# EAGLE schematic Relay-Board_Rack-PDU_2.0 (EAGLE 9.2.1)

## Sheet 1 of 3: POWER
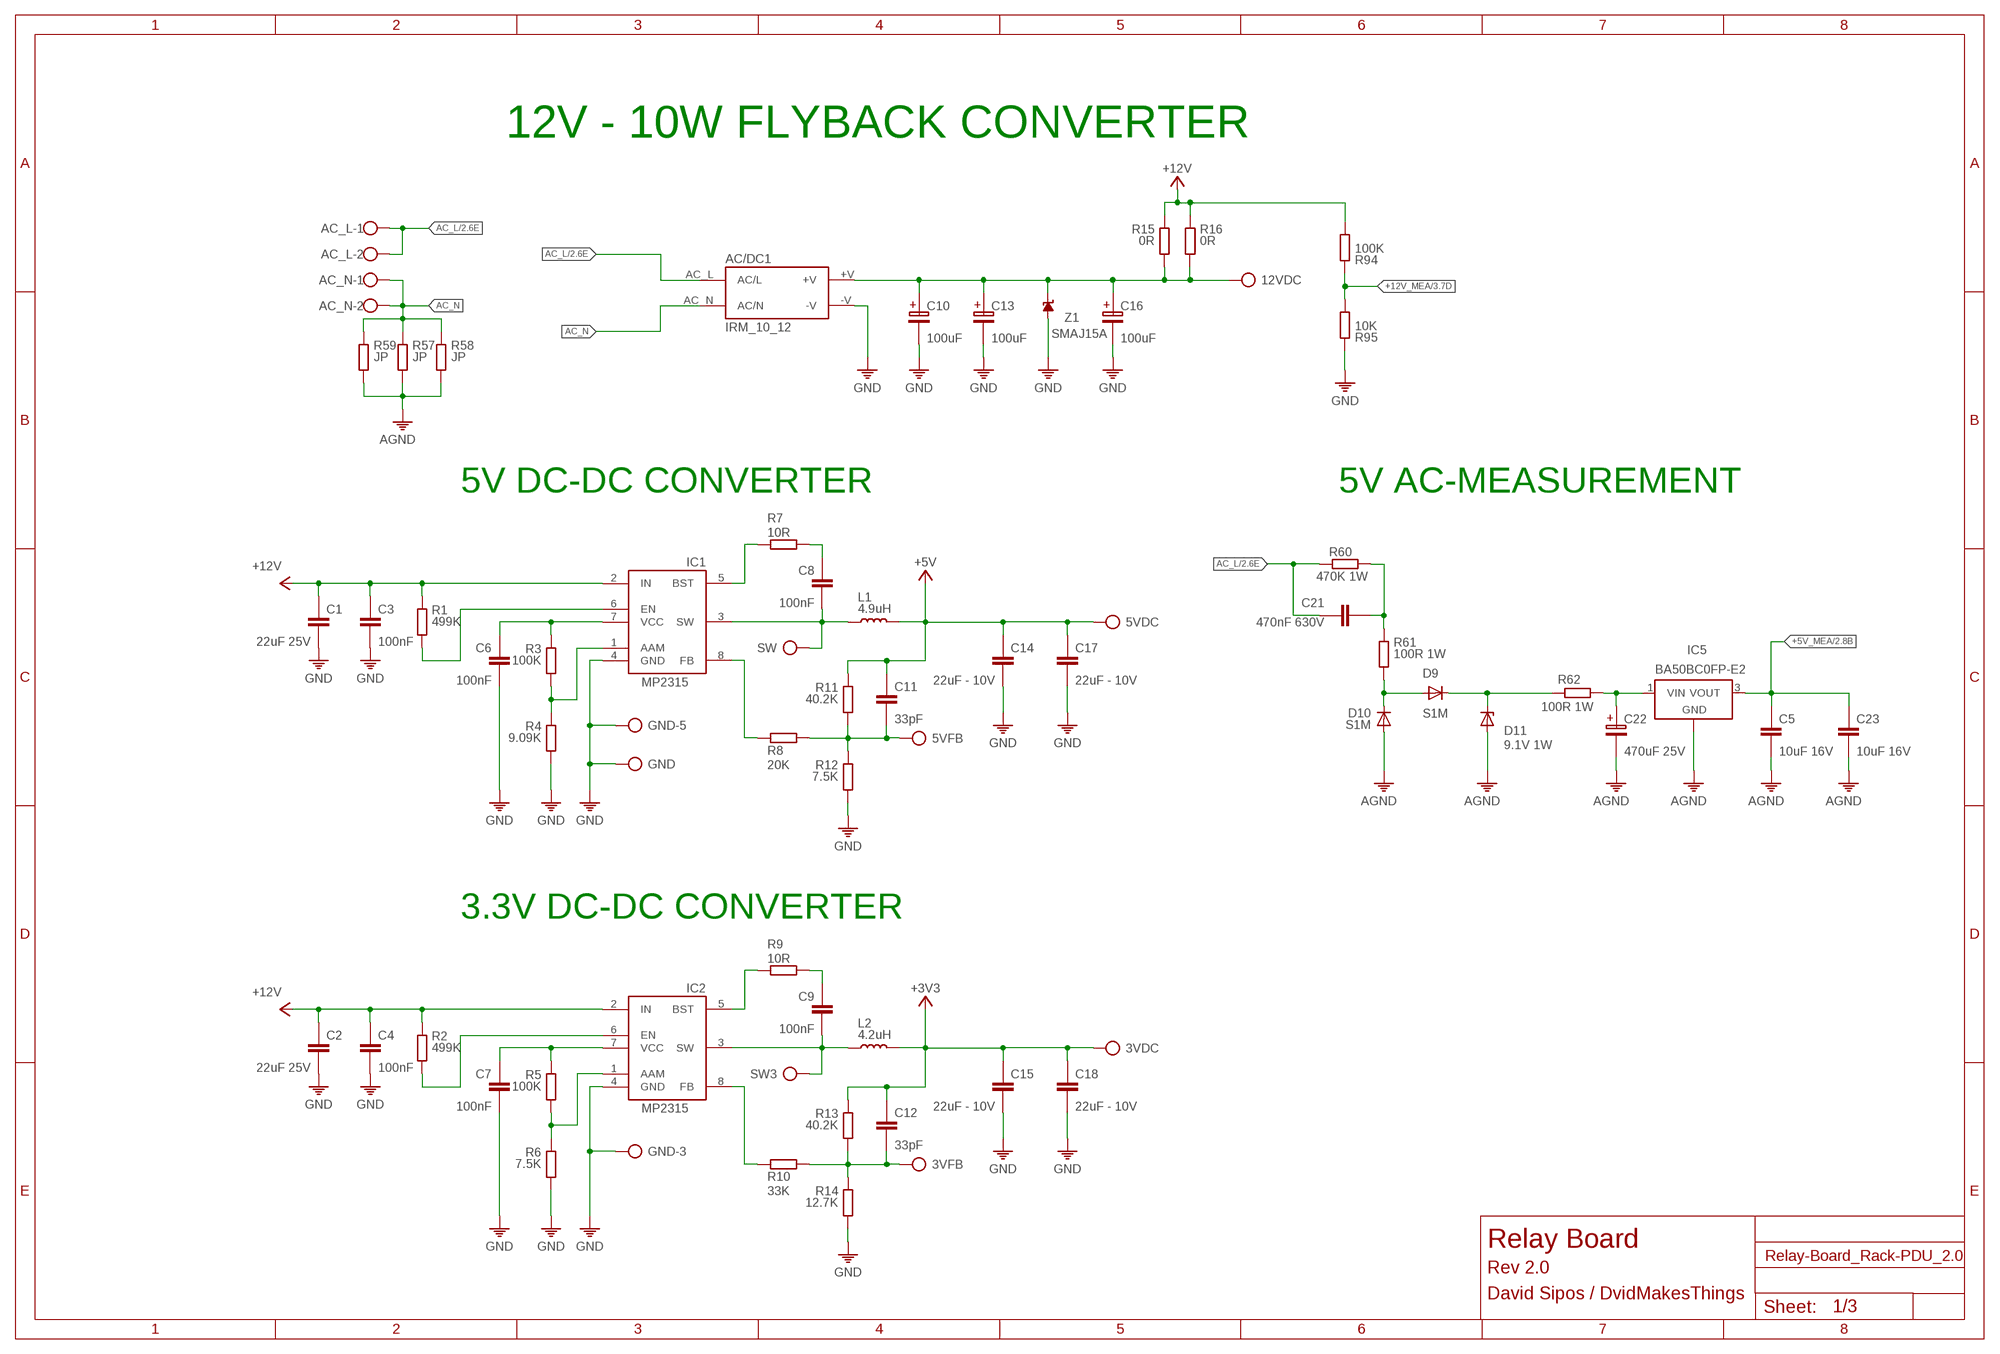
[diagram p0: schematic, sheet 1]

### Parts
3VDC  TP  [TP]
3VFB  TP  [TP]
5VDC  TP  [TP]
5VFB  TP  [TP]
12VDC  TP  [TP]
AC/DC1  IRM_10_12  [IRM_10_12]
AC_L  W237-102  [W237-102]
AC_N  W237-102  [W237-102]
C1  22uF 25V  C-1206  [C1206]
C2  22uF 25V  C-1206  [C1206]
C3  100nF  C0402  [0402]
C4  100nF  C0402  [0402]
C5  10uF 16V  C-1206  [C1206]
C6  100nF  C0402  [0402]
C7  100nF  C0402  [0402]
C8  100nF  C0402  [0402]
C9  100nF  C0402  [0402]
C10  100uF  CPOL  [100UF-16V]
C11  33pF  C0402  [0402]
C12  33pF  C0402  [0402]
C13  100uF  CPOL  [100UF-16V]
C14  22uF - 10V  C-1206  [C1206]
C15  22uF - 10V  C-1206  [C1206]
C16  100uF  CPOL  [100UF-16V]
C17  22uF - 10V  C-1206  [C1206]
C18  22uF - 10V  C-1206  [C1206]
C21  470nF 630V  C-2225  [2225]
C22  470uF 25V  CPOL  [100UF-16V]
C23  10uF 16V  C-1206  [C1206]
D9  S1M  [SMA]
D10  S1M  [SMA]
D11  9.1V 1W  ZENER-DIODESMB  [SMB]
GND  TP  [TP]
GND-3  TP  [TP]
GND-5  TP  [TP]
IC1  MP2315GJ-Z  MP2315TSOT23-8  [SOT65P280X110-8N]
IC2  MP2315S  MP2315TSOT23-8  [SOT65P280X110-8N]
IC5  BA50BC0FP-E2  L4941BDT  [DPAK]
L1  4.9uH  L  [SRR5228A]
L2  4.2uH  L  [SRR5228A]
R1  499K  R0402  [0402]
R2  499K  R0402  [0402]
R3  100K  R0402  [0402]
R4  9.09K  R0402  [0402]
R5  100K  R0402  [0402]
R6  7.5K  R0402  [0402]
R7  10R  R0402  [0402]
R8  20K  R0402  [0402]
R9  10R  R0402  [0402]
R10  33K  R0402  [0402]
R11  40.2K  R0402  [0402]
R12  7.5K  R0402  [0402]
R13  40.2K  R0402  [0402]
R14  12.7K  R0402  [0402]
R15  0R  R0805  [0805]
R16  0R  R0805  [0805]
R57  JP  R0402  [0402]
R58  JP  R0402  [0402]
R59  JP  R0402  [0402]
R60  470K 1W  R2512  [2512]
R61  100R 1W  R2512  [2512]
R62  100R 1W  R2512  [2512]
R94  100K  R0402  [0402]
R95  10K  R0402  [0402]
SW  TP  [TP]
SW3  TP  [TP]
Z1  SMAJ15A  SUPRESSOR_TVS-UD-SMAJ  [SUPRESSOR_SMAJ]

### Nets
5VFB: 5VFB.TP C11.2 R8.2 R11.2 R12.1
+3V3: 3VDC.TP C12.1 C15.1 C18.1 L2.2 R13.1 ; also sheet 3
+5V: 5VDC.TP C11.1 C14.1 C17.1 L1.2 R11.1 ; also sheet 3
+5V_MEA: C5.1 C23.1 IC5.3(VOUT) ; also sheet 2,3
+12V: C1.1 C2.1 C3.1 C4.1 IC1.2(IN) IC2.2(IN) R1.1 R2.1 R15.1 R16.1 R94.2 ; also sheet 2,3
+12V_MEA: R94.1 R95.2 ; also sheet 3
AC_L: AC/DC1.AC_L(AC/L) AC_L.1 AC_L.2 C21.1 R60.1 ; also sheet 2
AC_N: AC/DC1.AC_N(AC/N) AC_N.1 AC_N.2 R57.1 R58.1 R59.1
AGND: C5.2 C22.2 C23.2 D10.A D11.A IC5.4(GND) R57.2 R58.2 R59.2 ; also sheet 2
GND: AC/DC1.-V C1.2 C2.2 C3.2 C4.2 C6.2 C7.2 C10.2 C13.2 C14.2 C15.2 C16.2 C17.2 C18.2 GND-3.TP GND-5.TP GND.TP IC1.4(GND) IC2.4(GND) R4.2 R6.2 R12.2 R14.2 R95.1 Z1.A ; also sheet 3
N$2: 12VDC.TP AC/DC1.+V C10.1 C13.1 C16.1 R15.2 R16.2 Z1.C
N$3: C21.2 R60.2 R61.1
N$14: IC1.5(BST) R7.2
N$16: IC1.8(FB) R8.1
N$18: C8.1 R7.1
N$19: IC1.6(EN) R1.2
N$20: D9.A D10.C R61.2
N$21: C6.1 IC1.7(VCC) R3.1
N$25: C22.1 IC5.1(VIN) R62.2
N$26: D9.C D11.C R62.1
N$38: IC2.5(BST) R9.2
N$39: IC2.8(FB) R10.1
N$41: C9.1 R9.1
N$42: 3VFB.TP C12.2 R10.2 R13.2 R14.1
N$43: IC2.6(EN) R2.2
N$44: C7.1 IC2.7(VCC) R5.1
N$45: IC1.1(AAM) R3.2 R4.1
N$46: IC2.1(AAM) R5.2 R6.1
SW3: C9.2 IC2.3(SW) L2.1 SW3.TP
SW5: C8.2 IC1.3(SW) L1.1 SW.TP

### Notes on the sheet
- 12V - 10W FLYBACK CONVERTER
- 5V DC-DC CONVERTER | 5V AC-MEASUREMENT
- BA50BC0FP-E2
- 3.3V DC-DC CONVERTER
- Relay Board
- Rev 2.0
- David Sipos / DvidMakesThings

## Sheet 2 of 3: RELAYS
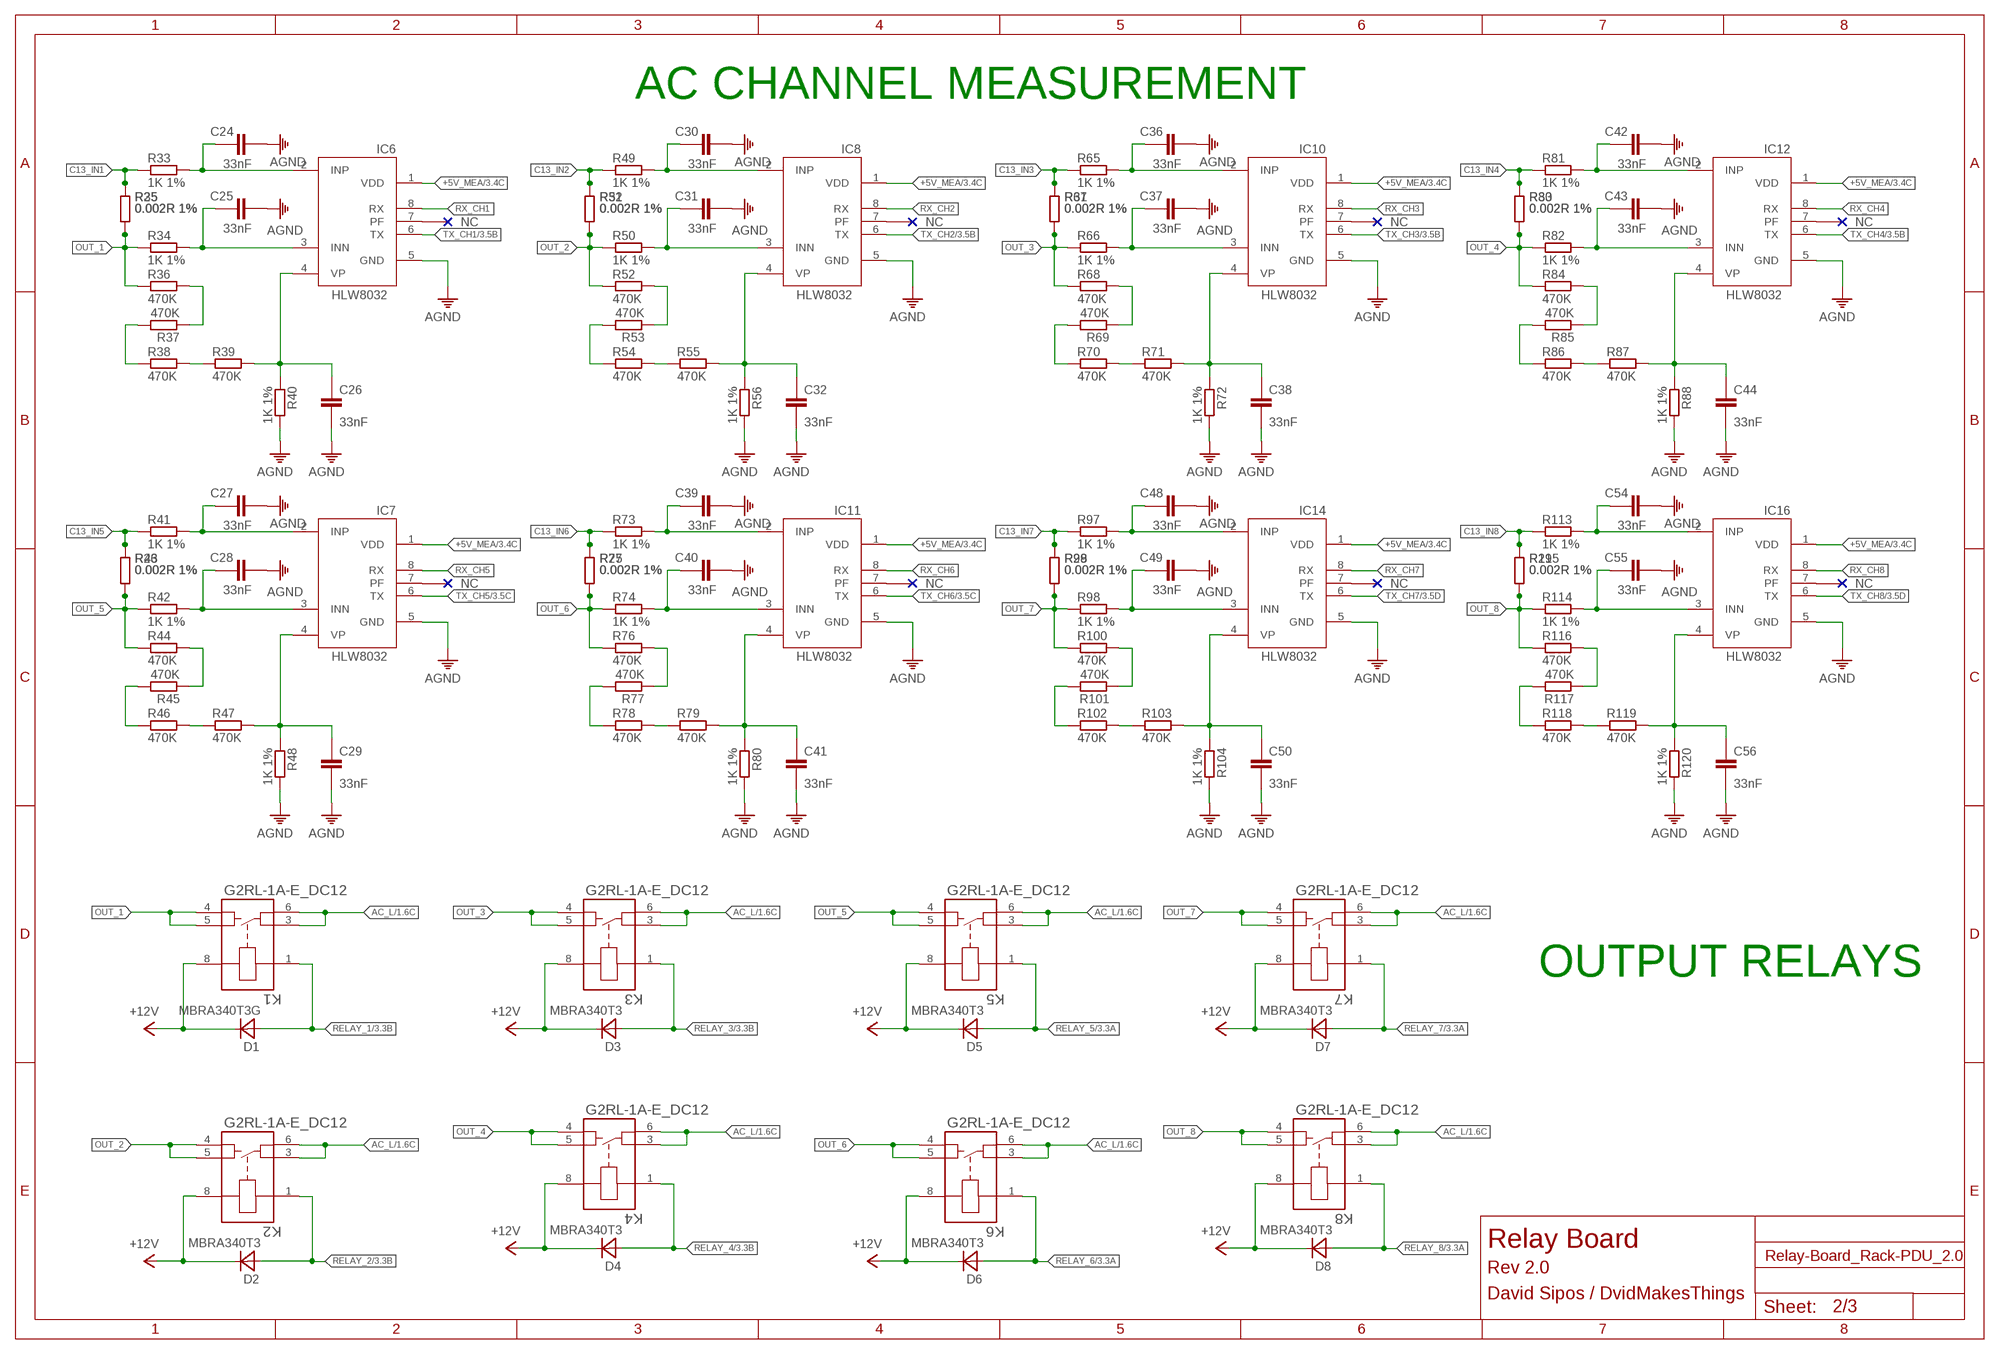
[diagram p1: schematic, sheet 2]

### Parts
C24  33nF  C-1206  [C1206]
C25  33nF  C-1206  [C1206]
C26  33nF  C-1206  [C1206]
C27  33nF  C-1206  [C1206]
C28  33nF  C-1206  [C1206]
C29  33nF  C-1206  [C1206]
C30  33nF  C-1206  [C1206]
C31  33nF  C-1206  [C1206]
C32  33nF  C-1206  [C1206]
C36  33nF  C-1206  [C1206]
C37  33nF  C-1206  [C1206]
C38  33nF  C-1206  [C1206]
C39  33nF  C-1206  [C1206]
C40  33nF  C-1206  [C1206]
C41  33nF  C-1206  [C1206]
C42  33nF  C-1206  [C1206]
C43  33nF  C-1206  [C1206]
C44  33nF  C-1206  [C1206]
C48  33nF  C-1206  [C1206]
C49  33nF  C-1206  [C1206]
C50  33nF  C-1206  [C1206]
C54  33nF  C-1206  [C1206]
C55  33nF  C-1206  [C1206]
C56  33nF  C-1206  [C1206]
D1  MBRA340T3G  MBRA340T3  [SMA]
D2  MBRA340T3  [SMA]
D3  MBRA340T3  [SMA]
D4  MBRA340T3  [SMA]
D5  MBRA340T3  [SMA]
D6  MBRA340T3  [SMA]
D7  MBRA340T3  [SMA]
D8  MBRA340T3  [SMA]
IC6  HLW8032  [SO8]
IC7  HLW8032  [SO8]
IC8  HLW8032  [SO8]
IC10  HLW8032  [SO8]
IC11  HLW8032  [SO8]
IC12  HLW8032  [SO8]
IC14  HLW8032  [SO8]
IC16  HLW8032  [SO8]
K1  G2RL-1A-E_DC12  [RELAY_G2RL-1A-E_DC5_OMR]
K2  G2RL-1A-E_DC12  [RELAY_G2RL-1A-E_DC5_OMR]
K3  G2RL-1A-E_DC12  [RELAY_G2RL-1A-E_DC5_OMR]
K4  G2RL-1A-E_DC12  [RELAY_G2RL-1A-E_DC5_OMR]
K5  G2RL-1A-E_DC12  [RELAY_G2RL-1A-E_DC5_OMR]
K6  G2RL-1A-E_DC12  [RELAY_G2RL-1A-E_DC5_OMR]
K7  G2RL-1A-E_DC12  [RELAY_G2RL-1A-E_DC5_OMR]
K8  G2RL-1A-E_DC12  [RELAY_G2RL-1A-E_DC5_OMR]
R25  0.002R 1%  R2512  [2512]
R26  0.002R 1%  R2512  [2512]
R27  0.002R 1%  R2512  [2512]
R28  0.002R 1%  R2512  [2512]
R29  0.002R 1%  R2512  [2512]
R30  0.002R 1%  R2512  [2512]
R31  0.002R 1%  R2512  [2512]
R32  0.002R 1%  R2512  [2512]
R33  1K 1%  R1206  [1206]
R34  1K 1%  R1206  [1206]
R35  0.002R 1%  R2512  [2512]
R36  470K  R1206  [1206]
R37  470K  R1206  [1206]
R38  470K  R1206  [1206]
R39  470K  R1206  [1206]
R40  1K 1%  R1206  [1206]
R41  1K 1%  R1206  [1206]
R42  1K 1%  R1206  [1206]
R43  0.002R 1%  R2512  [2512]
R44  470K  R1206  [1206]
R45  470K  R1206  [1206]
R46  470K  R1206  [1206]
R47  470K  R1206  [1206]
R48  1K 1%  R1206  [1206]
R49  1K 1%  R1206  [1206]
R50  1K 1%  R1206  [1206]
R51  0.002R 1%  R2512  [2512]
R52  470K  R1206  [1206]
R53  470K  R1206  [1206]
R54  470K  R1206  [1206]
R55  470K  R1206  [1206]
R56  1K 1%  R1206  [1206]
R65  1K 1%  R1206  [1206]
R66  1K 1%  R1206  [1206]
R67  0.002R 1%  R2512  [2512]
R68  470K  R1206  [1206]
R69  470K  R1206  [1206]
R70  470K  R1206  [1206]
R71  470K  R1206  [1206]
R72  1K 1%  R1206  [1206]
R73  1K 1%  R1206  [1206]
R74  1K 1%  R1206  [1206]
R75  0.002R 1%  R2512  [2512]
R76  470K  R1206  [1206]
R77  470K  R1206  [1206]
R78  470K  R1206  [1206]
R79  470K  R1206  [1206]
R80  1K 1%  R1206  [1206]
R81  1K 1%  R1206  [1206]
R82  1K 1%  R1206  [1206]
R83  0.002R 1%  R2512  [2512]
R84  470K  R1206  [1206]
R85  470K  R1206  [1206]
R86  470K  R1206  [1206]
R87  470K  R1206  [1206]
R88  1K 1%  R1206  [1206]
R97  1K 1%  R1206  [1206]
R98  1K 1%  R1206  [1206]
R99  0.002R 1%  R2512  [2512]
R100  470K  R1206  [1206]
R101  470K  R1206  [1206]
R102  470K  R1206  [1206]
R103  470K  R1206  [1206]
R104  1K 1%  R1206  [1206]
R113  1K 1%  R1206  [1206]
R114  1K 1%  R1206  [1206]
R115  0.002R 1%  R2512  [2512]
R116  470K  R1206  [1206]
R117  470K  R1206  [1206]
R118  470K  R1206  [1206]
R119  470K  R1206  [1206]
R120  1K 1%  R1206  [1206]

### Nets
+5V_MEA: IC6.1(VDD) IC7.1(VDD) IC8.1(VDD) IC10.1(VDD) IC11.1(VDD) IC12.1(VDD) IC14.1(VDD) IC16.1(VDD) ; also sheet 1,3
+12V: D1.C D2.C D3.C D4.C D5.C D6.C D7.C D8.C K1.8 K2.8 K3.8 K4.8 K5.8 K6.8 K7.8 K8.8 ; also sheet 1,3
AC_L: K1.3 K1.6 K2.3 K2.6 K3.3 K3.6 K4.3 K4.6 K5.3 K5.6 K6.3 K6.6 K7.3 K7.6 K8.3 K8.6 ; also sheet 1
AGND: C24.2 C25.2 C26.2 C27.2 C28.2 C29.2 C30.2 C31.2 C32.2 C36.2 C37.2 C38.2 C39.2 C40.2 C41.2 C42.2 C43.2 C44.2 C48.2 C49.2 C50.2 C54.2 C55.2 C56.2 IC6.5(GND) IC7.5(GND) IC8.5(GND) IC10.5(GND) IC11.5(GND) IC12.5(GND) IC14.5(GND) IC16.5(GND) R40.2 R48.2 R56.2 R72.2 R80.2 R88.2 R104.2 R120.2 ; also sheet 1
C13_IN1: R25.2 R33.1 R35.2
C13_IN2: R32.2 R49.1 R51.2
C13_IN3: R31.2 R65.1 R67.2
C13_IN4: R30.2 R81.1 R83.2
C13_IN5: R26.2 R41.1 R43.2
C13_IN6: R27.2 R73.1 R75.2
C13_IN7: R28.2 R97.1 R99.2
C13_IN8: R29.2 R113.1 R115.2
N$12: C24.1 IC6.2(INP) R33.2
N$22: C25.1 IC6.3(INN) R34.2
N$27: R36.2 R37.1
N$28: R37.2 R38.1
N$29: R38.2 R39.1
N$30: C26.1 IC6.4(VP) R39.2 R40.1
N$31: C27.1 IC7.2(INP) R41.2
N$32: C28.1 IC7.3(INN) R42.2
N$33: R44.2 R45.1
N$34: R45.2 R46.1
N$35: R46.2 R47.1
N$36: C29.1 IC7.4(VP) R47.2 R48.1
N$47: C30.1 IC8.2(INP) R49.2
N$48: C31.1 IC8.3(INN) R50.2
N$49: R52.2 R53.1
N$50: R53.2 R54.1
N$51: R54.2 R55.1
N$52: C32.1 IC8.4(VP) R55.2 R56.1
N$59: C36.1 IC10.2(INP) R65.2
N$60: C37.1 IC10.3(INN) R66.2
N$61: R68.2 R69.1
N$62: R69.2 R70.1
N$63: R70.2 R71.1
N$64: C38.1 IC10.4(VP) R71.2 R72.1
N$65: C39.1 IC11.2(INP) R73.2
N$66: C40.1 IC11.3(INN) R74.2
N$67: R76.2 R77.1
N$68: R77.2 R78.1
N$69: R78.2 R79.1
N$70: C41.1 IC11.4(VP) R79.2 R80.1
N$71: C42.1 IC12.2(INP) R81.2
N$72: C43.1 IC12.3(INN) R82.2
N$73: R84.2 R85.1
N$74: R85.2 R86.1
N$75: R86.2 R87.1
N$76: C44.1 IC12.4(VP) R87.2 R88.1
N$83: C48.1 IC14.2(INP) R97.2
N$84: C49.1 IC14.3(INN) R98.2
N$85: R100.2 R101.1
N$86: R101.2 R102.1
N$87: R102.2 R103.1
N$88: C50.1 IC14.4(VP) R103.2 R104.1
N$95: C54.1 IC16.2(INP) R113.2
N$96: C55.1 IC16.3(INN) R114.2
N$97: R116.2 R117.1
N$98: R117.2 R118.1
N$99: R118.2 R119.1
N$100: C56.1 IC16.4(VP) R119.2 R120.1
OUT_1: K1.4 K1.5 R25.1 R34.1 R35.1 R36.1
OUT_2: K2.4 K2.5 R32.1 R50.1 R51.1 R52.1
OUT_3: K3.4 K3.5 R31.1 R66.1 R67.1 R68.1
OUT_4: K4.4 K4.5 R30.1 R82.1 R83.1 R84.1
OUT_5: K5.4 K5.5 R26.1 R42.1 R43.1 R44.1
OUT_6: K6.4 K6.5 R27.1 R74.1 R75.1 R76.1
OUT_7: K7.4 K7.5 R28.1 R98.1 R99.1 R100.1
OUT_8: K8.4 K8.5 R29.1 R114.1 R115.1 R116.1
RELAY_1: D1.A K1.1 ; also sheet 3
RELAY_2: D2.A K2.1 ; also sheet 3
RELAY_3: D3.A K3.1 ; also sheet 3
RELAY_4: D4.A K4.1 ; also sheet 3
RELAY_5: D5.A K5.1 ; also sheet 3
RELAY_6: D6.A K6.1 ; also sheet 3
RELAY_7: D7.A K7.1 ; also sheet 3
RELAY_8: D8.A K8.1 ; also sheet 3
RX_CH1: IC6.8(RX)
RX_CH2: IC8.8(RX)
RX_CH3: IC10.8(RX)
RX_CH4: IC12.8(RX)
RX_CH5: IC7.8(RX)
RX_CH6: IC11.8(RX)
RX_CH7: IC14.8(RX)
RX_CH8: IC16.8(RX)
TX_CH1: IC6.6(TX) ; also sheet 3
TX_CH2: IC8.6(TX) ; also sheet 3
TX_CH3: IC10.6(TX) ; also sheet 3
TX_CH4: IC12.6(TX) ; also sheet 3
TX_CH5: IC7.6(TX) ; also sheet 3
TX_CH6: IC11.6(TX) ; also sheet 3
TX_CH7: IC14.6(TX) ; also sheet 3
TX_CH8: IC16.6(TX) ; also sheet 3
Unconnected: IC6.7(PF) IC7.7(PF) IC8.7(PF) IC10.7(PF) IC11.7(PF) IC12.7(PF) IC14.7(PF) IC16.7(PF)

### Notes on the sheet
- AC CHANNEL MEASUREMENT
- OUTPUT RELAYS
- Relay Board
- Rev 2.0
- David Sipos / DvidMakesThings

## Sheet 3 of 3: DRIVERS AND PERIPHERALS
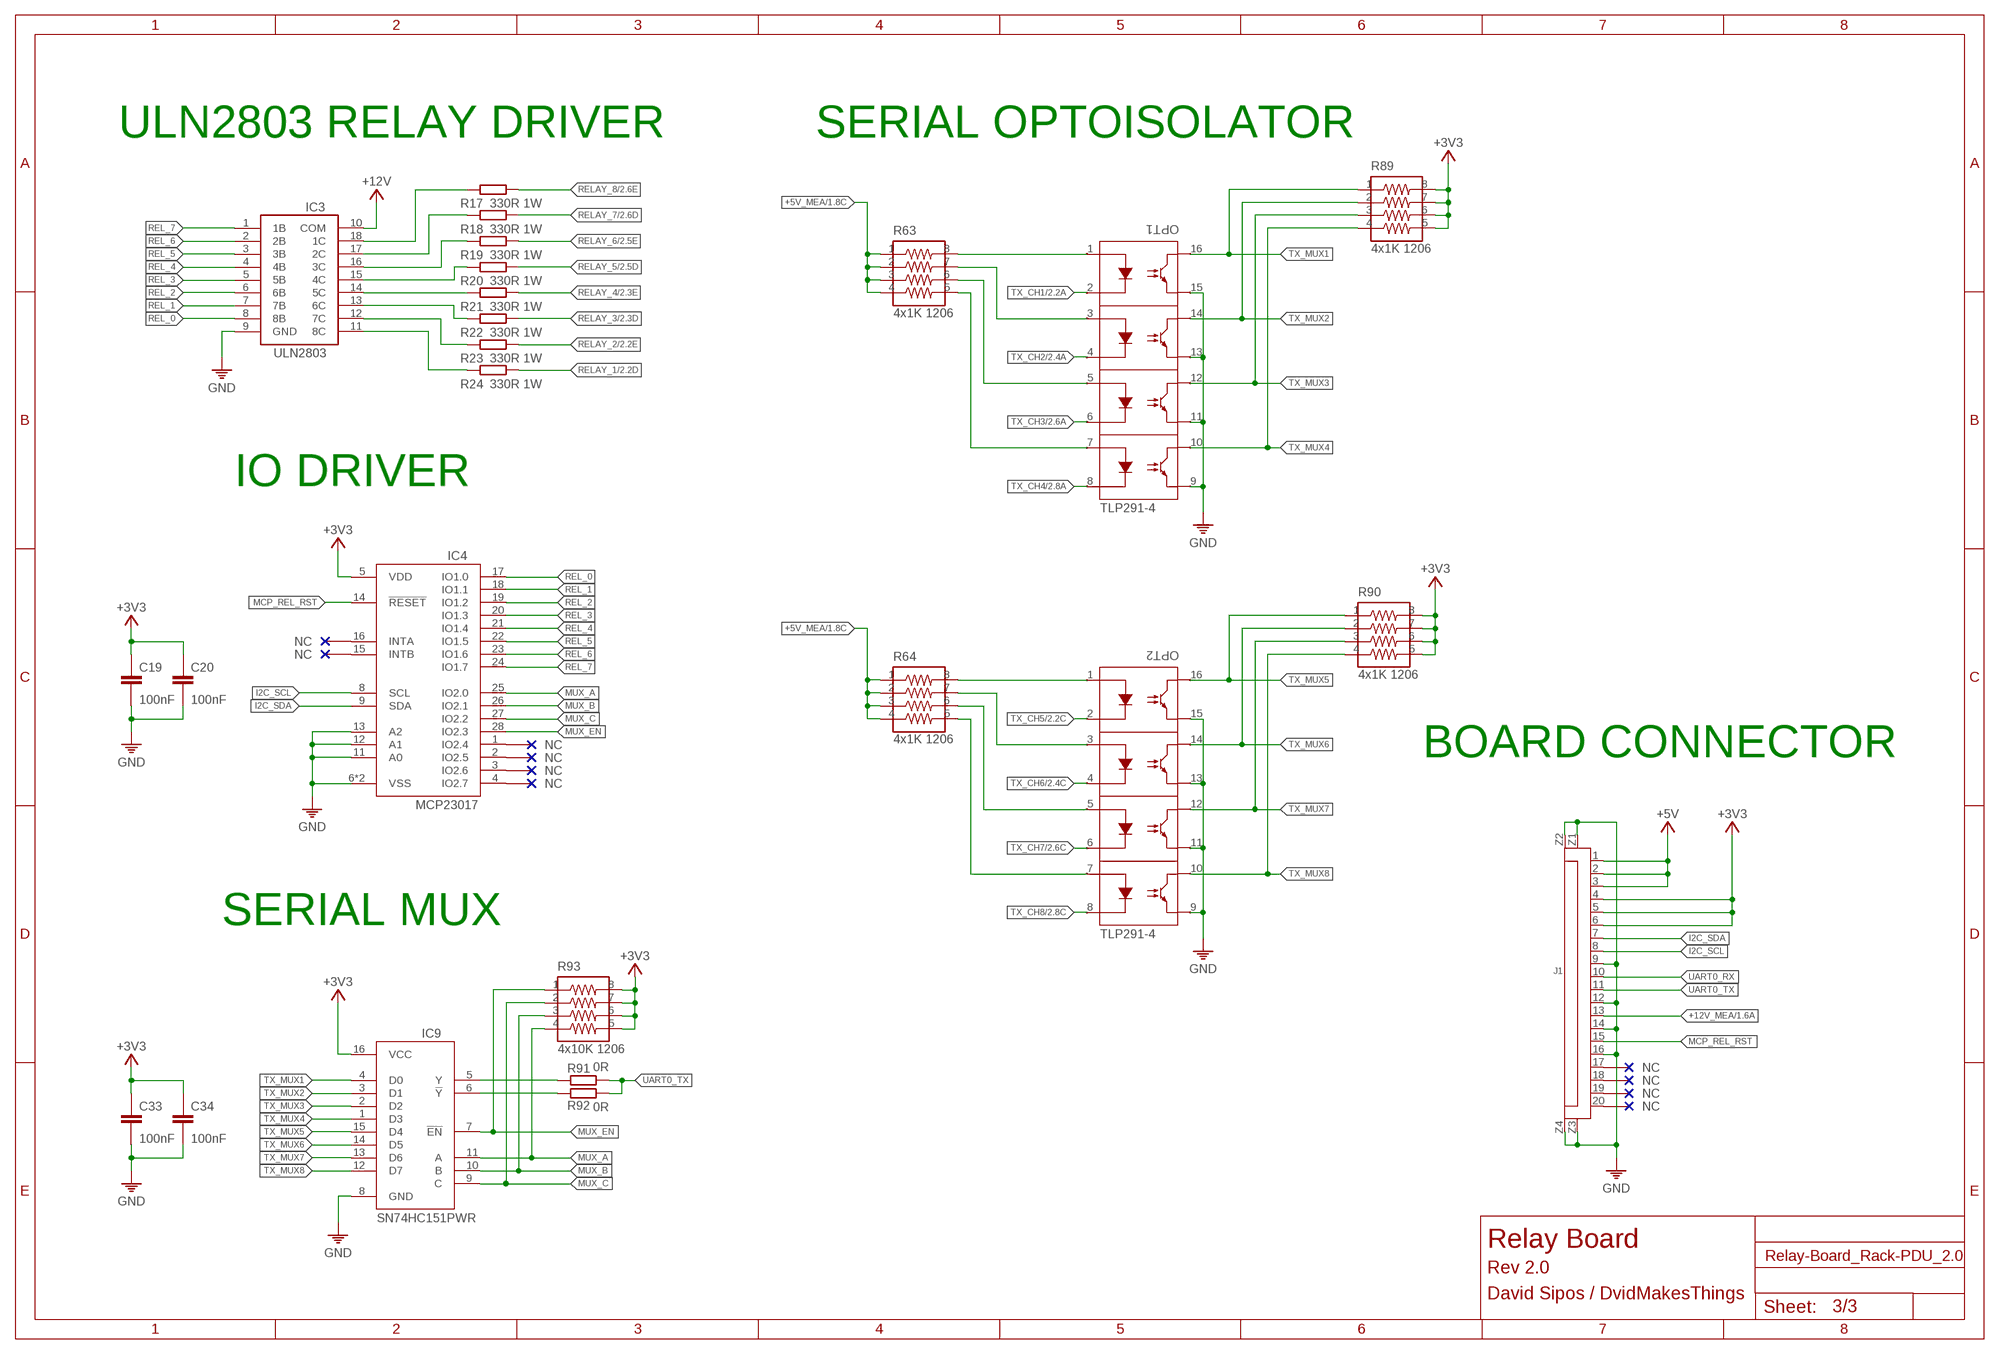
[diagram p2: schematic, sheet 3]

### Parts
C19  100nF  C-0402  [C0402]
C20  100nF  C-0402  [C0402]
C33  100nF  C-0402  [C0402]
C34  100nF  C-0402  [C0402]
IC3  ULN2803A  ULN2803  [SO18]
IC4  MCP23017-E/ML  [QFN28[6X6]ML]
IC9  SN74HC151PWR  [TSSOP16]
J1  FPC20-H  [FPC20]
OPT1  TLP291-4  TLP291-4(GB-TP,E)1  [SO16]
OPT2  TLP291-4  TLP291-4(GB-TP,E)1  [SO16]
R17  330R 1W  R1206  [1206]
R18  330R 1W  R1206  [1206]
R19  330R 1W  R1206  [1206]
R20  330R 1W  R1206  [1206]
R21  330R 1W  R1206  [1206]
R22  330R 1W  R1206  [1206]
R23  330R 1W  R1206  [1206]
R24  330R 1W  R1206  [1206]
R63  4x1K 1206  742C083103JP  [742C083103JP]
R64  4x1K 1206  742C083103JP  [742C083103JP]
R89  4x1K 1206  742C083103JP  [742C083103JP]
R90  4x1K 1206  742C083103JP  [742C083103JP]
R91  0R  R0402  [0402]
R92  0R  R0402  [0402]
R93  4x10K 1206  742C083103JP  [742C083103JP]

### Nets
+3V3: C19.1 C20.1 C33.1 C34.1 IC4.5(VDD) IC9.16(VCC) J1.4 J1.5 J1.6 R89.5 R89.6 R89.7 R89.8 R90.5 R90.6 R90.7 R90.8 R93.5 R93.6 R93.7 R93.8 ; also sheet 1
+5V: J1.1 J1.2 J1.3 ; also sheet 1
+5V_MEA: R63.1 R63.2 R63.3 R63.4 R64.1 R64.2 R64.3 R64.4 ; also sheet 1,2
+12V: IC3.10(COM) ; also sheet 1,2
+12V_MEA: J1.13 ; also sheet 1
GND: C19.2 C20.2 C33.2 C34.2 IC3.9(GND) IC4.6(VSS) IC4.11(A0) IC4.12(A1) IC4.13(A2) IC4.PAD(VSS) IC9.8(GND) J1.9 J1.12 J1.14 J1.16 J1.Z1 J1.Z2 J1.Z3 J1.Z4 OPT1.9 OPT1.11 OPT1.13 OPT1.15 OPT2.9 OPT2.11 OPT2.13 OPT2.15 ; also sheet 1
I2C_SCL: IC4.8(SCL) J1.8
I2C_SDA: IC4.9(SDA) J1.7
MCP_REL_RST: IC4.14(!RESET) J1.15
MUX_A: IC4.25(IO2.0) IC9.11(A) R93.4
MUX_B: IC4.26(IO2.1) IC9.10(B) R93.3
MUX_C: IC4.27(IO2.2) IC9.9(C) R93.2
MUX_EN: IC4.28(IO2.3) IC9.7(!EN) R93.1
N$1: IC9.5(Y) R91.1
N$4: IC3.14(5C) R21.1
N$5: OPT1.1 R63.8
N$6: IC3.11(8C) R24.1
N$7: IC3.12(7C) R23.1
N$8: IC3.13(6C) R22.1
N$9: OPT1.3 R63.7
N$10: IC3.15(4C) R20.1
N$11: IC3.16(3C) R19.1
N$13: IC3.17(2C) R18.1
N$15: IC3.18(1C) R17.1
N$17: OPT1.5 R63.6
N$23: OPT1.7 R63.5
N$24: IC9.6(!Y) R92.1
N$37: OPT2.1 R64.8
N$40: OPT2.3 R64.7
N$53: OPT2.5 R64.6
N$54: OPT2.7 R64.5
REL_0: IC3.8(8B) IC4.17(IO1.0)
REL_1: IC3.7(7B) IC4.18(IO1.1)
REL_2: IC3.6(6B) IC4.19(IO1.2)
REL_3: IC3.5(5B) IC4.20(IO1.3)
REL_4: IC3.4(4B) IC4.21(IO1.4)
REL_5: IC3.3(3B) IC4.22(IO1.5)
REL_6: IC3.2(2B) IC4.23(IO1.6)
REL_7: IC3.1(1B) IC4.24(IO1.7)
RELAY_1: R24.2 ; also sheet 2
RELAY_2: R23.2 ; also sheet 2
RELAY_3: R22.2 ; also sheet 2
RELAY_4: R21.2 ; also sheet 2
RELAY_5: R20.2 ; also sheet 2
RELAY_6: R19.2 ; also sheet 2
RELAY_7: R18.2 ; also sheet 2
RELAY_8: R17.2 ; also sheet 2
TX_CH1: OPT1.2 ; also sheet 2
TX_CH2: OPT1.4 ; also sheet 2
TX_CH3: OPT1.6 ; also sheet 2
TX_CH4: OPT1.8 ; also sheet 2
TX_CH5: OPT2.2 ; also sheet 2
TX_CH6: OPT2.4 ; also sheet 2
TX_CH7: OPT2.6 ; also sheet 2
TX_CH8: OPT2.8 ; also sheet 2
TX_MUX1: IC9.4(D0) OPT1.16 R89.1
TX_MUX2: IC9.3(D1) OPT1.14 R89.2
TX_MUX3: IC9.2(D2) OPT1.12 R89.3
TX_MUX4: IC9.1(D3) OPT1.10 R89.4
TX_MUX5: IC9.15(D4) OPT2.16 R90.1
TX_MUX6: IC9.14(D5) OPT2.14 R90.2
TX_MUX7: IC9.13(D6) OPT2.12 R90.3
TX_MUX8: IC9.12(D7) OPT2.10 R90.4
UART0_RX: J1.10
UART0_TX: J1.11 R91.2 R92.2
Unconnected: IC4.1(IO2.4) IC4.2(IO2.5) IC4.3(IO2.6) IC4.4(IO2.7) IC4.15(INTB) IC4.16(INTA) J1.17 J1.18 J1.19 J1.20

### Notes on the sheet
- ULN2803 RELAY DRIVER | SERIAL OPTOISOLATOR
- IO DRIVER
- BOARD CONNECTOR
- SERIAL MUX
- Relay Board
- Rev 2.0
- David Sipos / DvidMakesThings

## Library data of the parts
3VDC 3VFB 5VDC 5VFB 12VDC GND GND-3 GND-5 SW SW3 = ds_passive:TP
AC/DC1 = ds_trafo:IRM_10_12: 10W AC-DC PCB-Mount Green Power Module
AC_L AC_N = con-wago-500:W237-102: WAGO SCREW CLAMP; MPN: 237-102; OC_FARNELL: unknown; OC_NEWARK: 70K9898
C1-C9 C11 C12 C14 C15 C17-C21 C23-C34 C36-C44 C48-C50 C54-C56 = ds_passive:C
C10 C13 C16 C22 = ds_passive:CPOL
D1-D8 = diode:MBRA340T3: Surface Mount Schottky Power Rectifier Source: http://www.onsemi.com/pub_link/Collateral/MBRA340T3-D.PDF
D9 D10 = diode:S1M
D11 = diode:ZENER-DIODE: Z-Diode
IC1 IC2 = ds_ic_vreg:MP2315: Description The MP2315 is a high frequency synchronous rectified step-down switch mode converter with built in internal power MOSFETs. It offers a very compact solution to achieve 3A continuous output current over a wide input supply range with excellent load and line regulation. The MP2315 has synchronous mode operation for higher efficiency over output current load range. Current mode operation provides fast transient response and eases loop stabilization. Full protection features include OCP and thermal shut down.
IC3 = ds_ic_peripherals:ULN2803: ULN2803A Darlington Transistor Arrays
IC4 = ds_ic_peripherals:MCP23017: 16-Bit I2C I/O Expander with Serial Interface
IC5 = ds_ic_vreg:L4941BDT: VERY LOW DROP 1A REGULATOR
IC6-IC8 IC10-IC12 IC14 IC16 = ds_ic_peripherals:HLW8032: Single-phase metering IC
IC9 = ds_ic_logic:SN74HC151PWR: 8-Line To 1-Line Data Selectors/Multiplexers
J1 = ds_con:FPC20-H
K1-K8 = ds_passive:G2RL-1A-E_DC12; COPYRIGHT: Copyright (C) 2025 Ultra Librarian. All rights reserved.; MANUFACTURER_PART_NUMBER: G2RL-1A-E DC12; MFR_NAME: Omron
L1 L2 = ds_passive:L
OPT1 OPT2 = ds_ic_peripherals:TLP291-4(GB-TP,E)
R1-R62 R65-R88 R91 R92 R94 R95 R97-R104 R113-R120 = ds_passive:R
R63 R64 R89 R90 R93 = Resistor Array:742C083103JP: RES ARRAY 4 RES 10K OHM 1206 Manufacturer's datasheet <https://www.ctscorp.com/wp-content/uploads/74x.pdf>; CREATED_BY: PCBLayout.com; DIGIKEY_PN: 742C083103JPTR-ND; MANUFACTURER: CTS Resistor Products; MPN: 742C083103JP; PACKAGE: 1206
Z1 = 52101-101-REV-A_v16:SUPRESSOR_TVS-UD-: TVS UNI-DIRECTIONAL

## Net classes
0 default: width 0.2 mm, drill 0.3 mm, clearance 0.191 mm